# EAGLE design quartzGenerator (EAGLE 6.4)
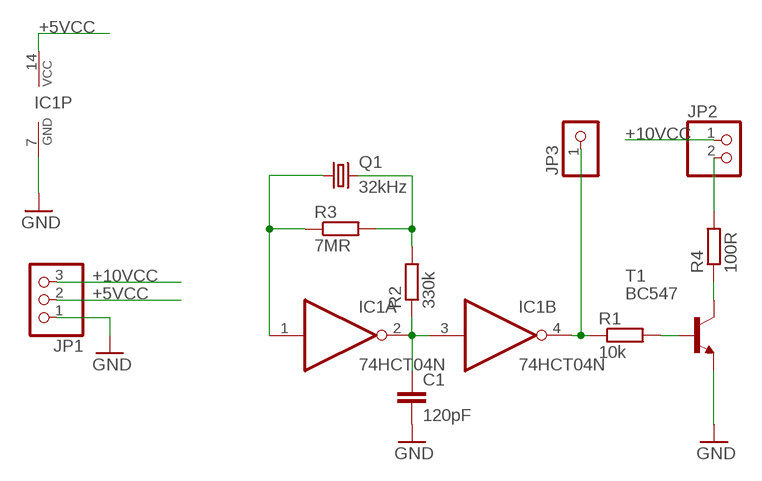
[diagram p0: schematic, sheet 1]

## Parts
C1  120pF  C-EU050-030X075  [C050-030X075]
IC1  74HCT04N  [DIL14]
JP1  PINHD-1X3  [1X03]
JP2  PINHD-1X2  [1X02]
JP3  PINHD-1X1  [1X01]
Q1  32kHz  CRYSTALTC26H  [TC26H]
R1  10k  R-EU_0207/7  [0207/7]
R2  330k  R-EU_0207/7  [0207/7]
R3  7MR  R-EU_0207/7  [0207/7]
R4  100R  R-EU_0207/7  [0207/7]
T1  BC547  [TO92]

## Nets
+5VCC: IC1.14(P:VCC) JP1.2
+10VCC: JP1.3 JP2.1
GND: C1.2 IC1.7(P:GND) JP1.1 T1.1(E)
N$1: IC1.1(A:I) Q1.1 R3.1
N$2: C1.1 IC1.2(A:O) IC1.3(B:I) R2.1
N$3: Q1.2 R2.2 R3.2
N$4: IC1.4(B:O) JP3.1 R1.1
N$5: R1.2 T1.2(B)
N$6: R4.1 T1.3(C)
N$7: JP2.2 R4.2
Unconnected: IC1.5(C:I) IC1.6(C:O) IC1.8(D:O) IC1.9(D:I) IC1.10(E:O) IC1.11(E:I) IC1.12(F:O) IC1.13(F:I)

## Library data of the parts
C1 = rcl:C-EU: CAPACITOR, European symbol
IC1 = 74xx-eu:74*04: Hex INVERTER
JP1 = pinhead:PINHD-1X3: PIN HEADER
JP2 = pinhead:PINHD-1X2: PIN HEADER
JP3 = pinhead:PINHD-1X1: PIN HEADER
Q1 = crystal:CRYSTAL: CRYSTAL; OC_FARNELL: unknown; OC_NEWARK: unknown
R1-R4 = rcl:R-EU_: RESISTOR, European symbol
T1 = transistor:BC547: NPN TRANSISTOR

## Board
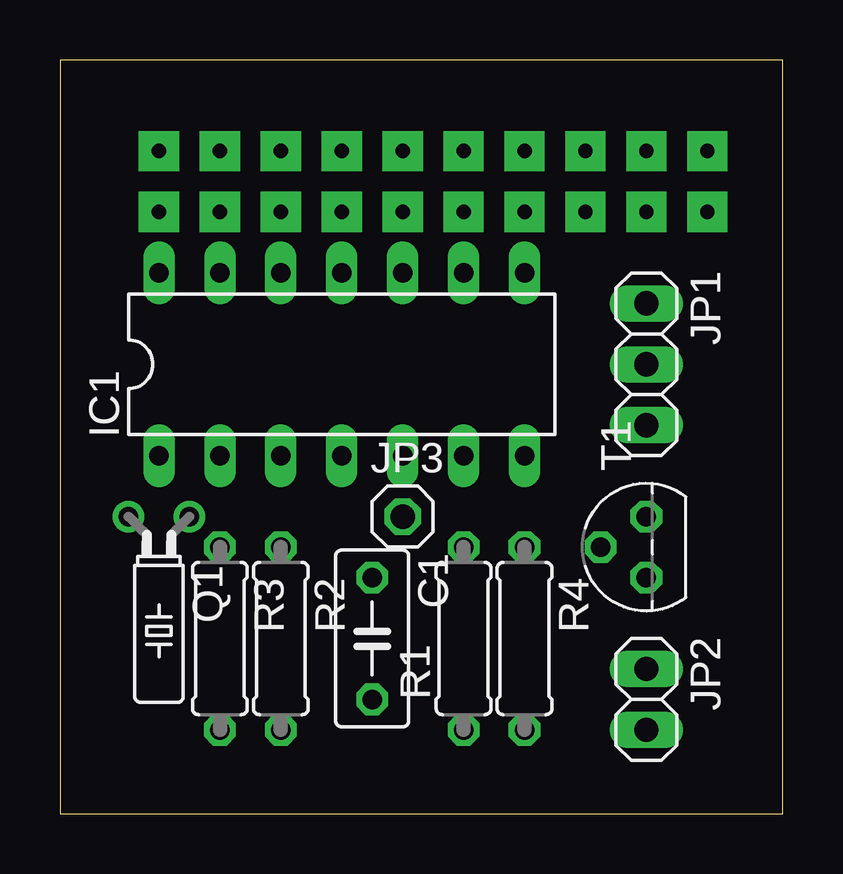
[diagram p1: board, top side]
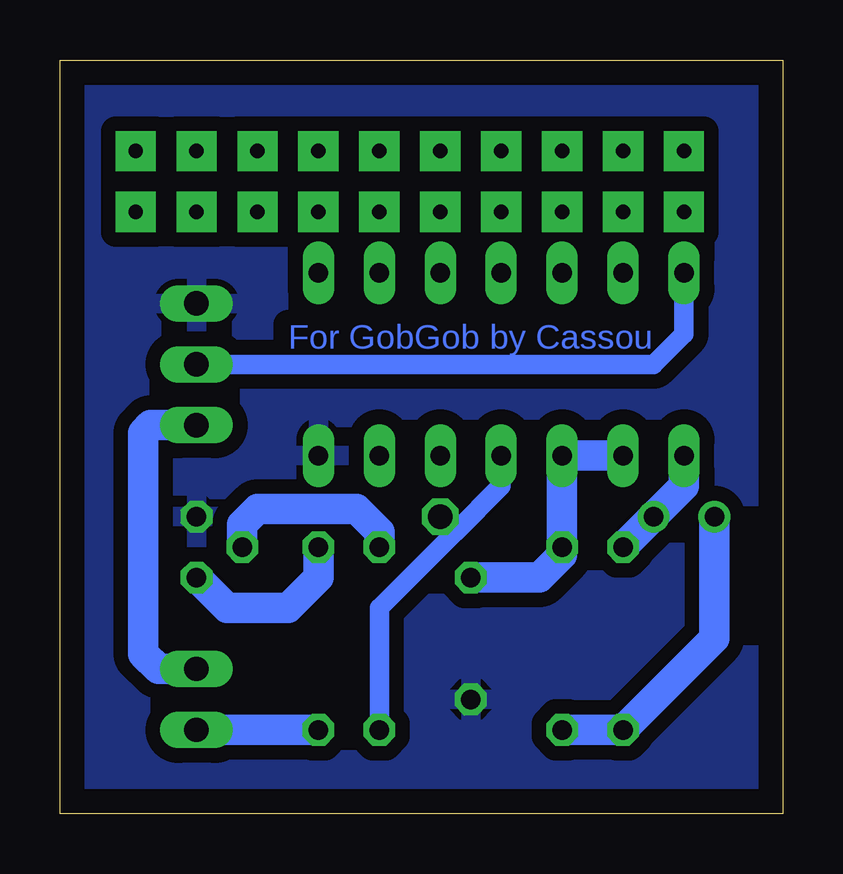
[diagram p2: board, bottom side, seen from below]

Size 30.14 x 31.42 mm. Coordinates in mm from the lower left corner, seen from the top.
Outline: 0,0 30.14,0 30.14,31.42 0,31.42 0,0
Copper layers (1*16): Top 0.035mm / dielectric 1.5mm / Bottom 0.035mm
Design rules "default": minimum track width 10mil, minimum drill 24mil, track to track 8mil, track to pad 8mil, pad to pad 8mil, via to via 8mil, smd to smd 8mil, copper to edge 40mil, drill to drill 8mil, minimum pad ring 10mil, minimum via ring 8mil, stop-mask expansion 4mil, vias tented up to drill 0mil, thermal gap 10mil

### Footprints (pad centres in the part's own frame; a part is rotated, then mirrored left to right if it is on the bottom)
C050-030X075 = drill 0.813 octagon: 1 -2.54,0; 2 2.54,0
DIL14 = drill 0.813 long: 1 -7.62,-3.81; 2 -5.08,-3.81; 3 -2.54,-3.81; 4 0,-3.81; 5 2.54,-3.81; 6 5.08,-3.81; 7 7.62,-3.81; 8 7.62,3.81; 9 5.08,3.81; 10 2.54,3.81; 11 0,3.81; 12 -2.54,3.81; 13 -5.08,3.81; 14 -7.62,3.81
1X03 = drill 1.016 long: 1 -2.54,0; 2 0,0; 3 2.54,0
1X02 = drill 1.016 long: 1 -1.27,0; 2 1.27,0
1X01 = drill 1.016 octagon: 1 0,0
TC26H = drill 0.813: 1 -1.27,0; 2 1.27,0
0207/7 = drill 0.813 octagon: 1 -3.81,0; 2 3.81,0
TO92 = drill 0.813 octagon: 1 1.27,0; 2 0,1.905; 3 -1.27,0

### Placement (x,y rotation side)
C1  13.02,7.3 270 top
IC1  11.75,18.73 0 top
JP1  24.45,18.73 270 top
JP2  24.45,4.76 270 top
JP3  14.29,12.38 0 top
Q1  4.13,12.38 180 top
R1  16.83,7.3 90 top
R2  9.21,7.3 270 top
R3  6.67,7.3 270 top
R4  19.37,7.3 270 top
T1  24.45,11.11 90 top

### Tracks (layer width: path | path; a pad name or v marks a point on that pad's centre or on a via)
+5VCC
  Bottom 0.813: IC1.14 4.13,20 5.4,18.73 JP1.2
+10VCC
  Bottom 1.27: JP1.3 26.35,16.19 26.67,15.88 26.67,6.67 26.04,6.03 JP2.1
GND
  pour Bottom (isolate 0.61): 0.95,30.16 0.95,0.95 28.89,0.95 28.89,30.16
N$1
  Bottom 1.27: R3.1 Q1.1 4.13,13.65 IC1.1
N$2
  Bottom 1.27: IC1.2 IC1.3 R2.1 9.21,10.79 10.16,9.84 C1.1
N$3
  Bottom 1.27: Q1.2 2.86,7.3 R3.2 R2.2
N$4
  Bottom 0.813: R1.1 16.83,8.57 13.65,11.75 | 13.65,11.75 11.75,13.65 IC1.4 | JP3.1 13.65,11.75
N$5
  Bottom 1.27: R1.2 16.83,11.75 17.78,12.7 21.91,12.7 22.54,12.06 T1.2
N$6
  Bottom 1.27: R4.1 19.37,9.84 20.64,8.57 23.18,8.57 T1.3
N$7
  Bottom 1.27: R4.2 JP2.2
N$8  (via drill 0.6 pad 1.68)
  other vias: 6.67,27.62
N$9  (via drill 0.6 pad 1.68)
  other vias: 6.67,25.08
N$10  (via drill 0.6 pad 1.68)
  other vias: 9.21,25.08
N$11  (via drill 0.6 pad 1.68)
  other vias: 11.75,25.08
N$12  (via drill 0.6 pad 1.68)
  other vias: 14.29,25.08
N$13  (via drill 0.6 pad 1.68)
  other vias: 16.83,25.08
N$14  (via drill 0.6 pad 1.68)
  other vias: 19.37,25.08
N$15  (via drill 0.6 pad 1.68)
  other vias: 9.21,27.62
N$16  (via drill 0.6 pad 1.68)
  other vias: 11.75,27.62
N$17  (via drill 0.6 pad 1.68)
  other vias: 14.29,27.62
N$18  (via drill 0.6 pad 1.68)
  other vias: 16.83,27.62
N$19  (via drill 0.6 pad 1.68)
  other vias: 19.37,27.62
N$20  (via drill 0.6 pad 1.68)
  other vias: 4.13,25.08
N$21  (via drill 0.6 pad 1.68)
  other vias: 4.13,27.62
N$22  (via drill 0.6 pad 1.68)
  other vias: 21.91,25.08
N$23  (via drill 0.6 pad 1.68)
  other vias: 21.91,27.62
N$24  (via drill 0.6 pad 1.68)
  other vias: 24.45,27.62
N$25  (via drill 0.6 pad 1.68)
  other vias: 24.45,25.08
N$26  (via drill 0.6 pad 1.68)
  other vias: 26.99,25.08
N$27  (via drill 0.6 pad 1.68)
  other vias: 26.99,27.62

### Text on the board
Bottom: For GobGob by Cassou
_tNames: JP1 | IC1 | JP3 | T1 | C1 | Q1 | R3 | R2 | R4 | JP2 | R1